# Altium project Orient2.PrjPcb (part 4 of 6)

## Sheet P06_Boot.SchDoc
size A
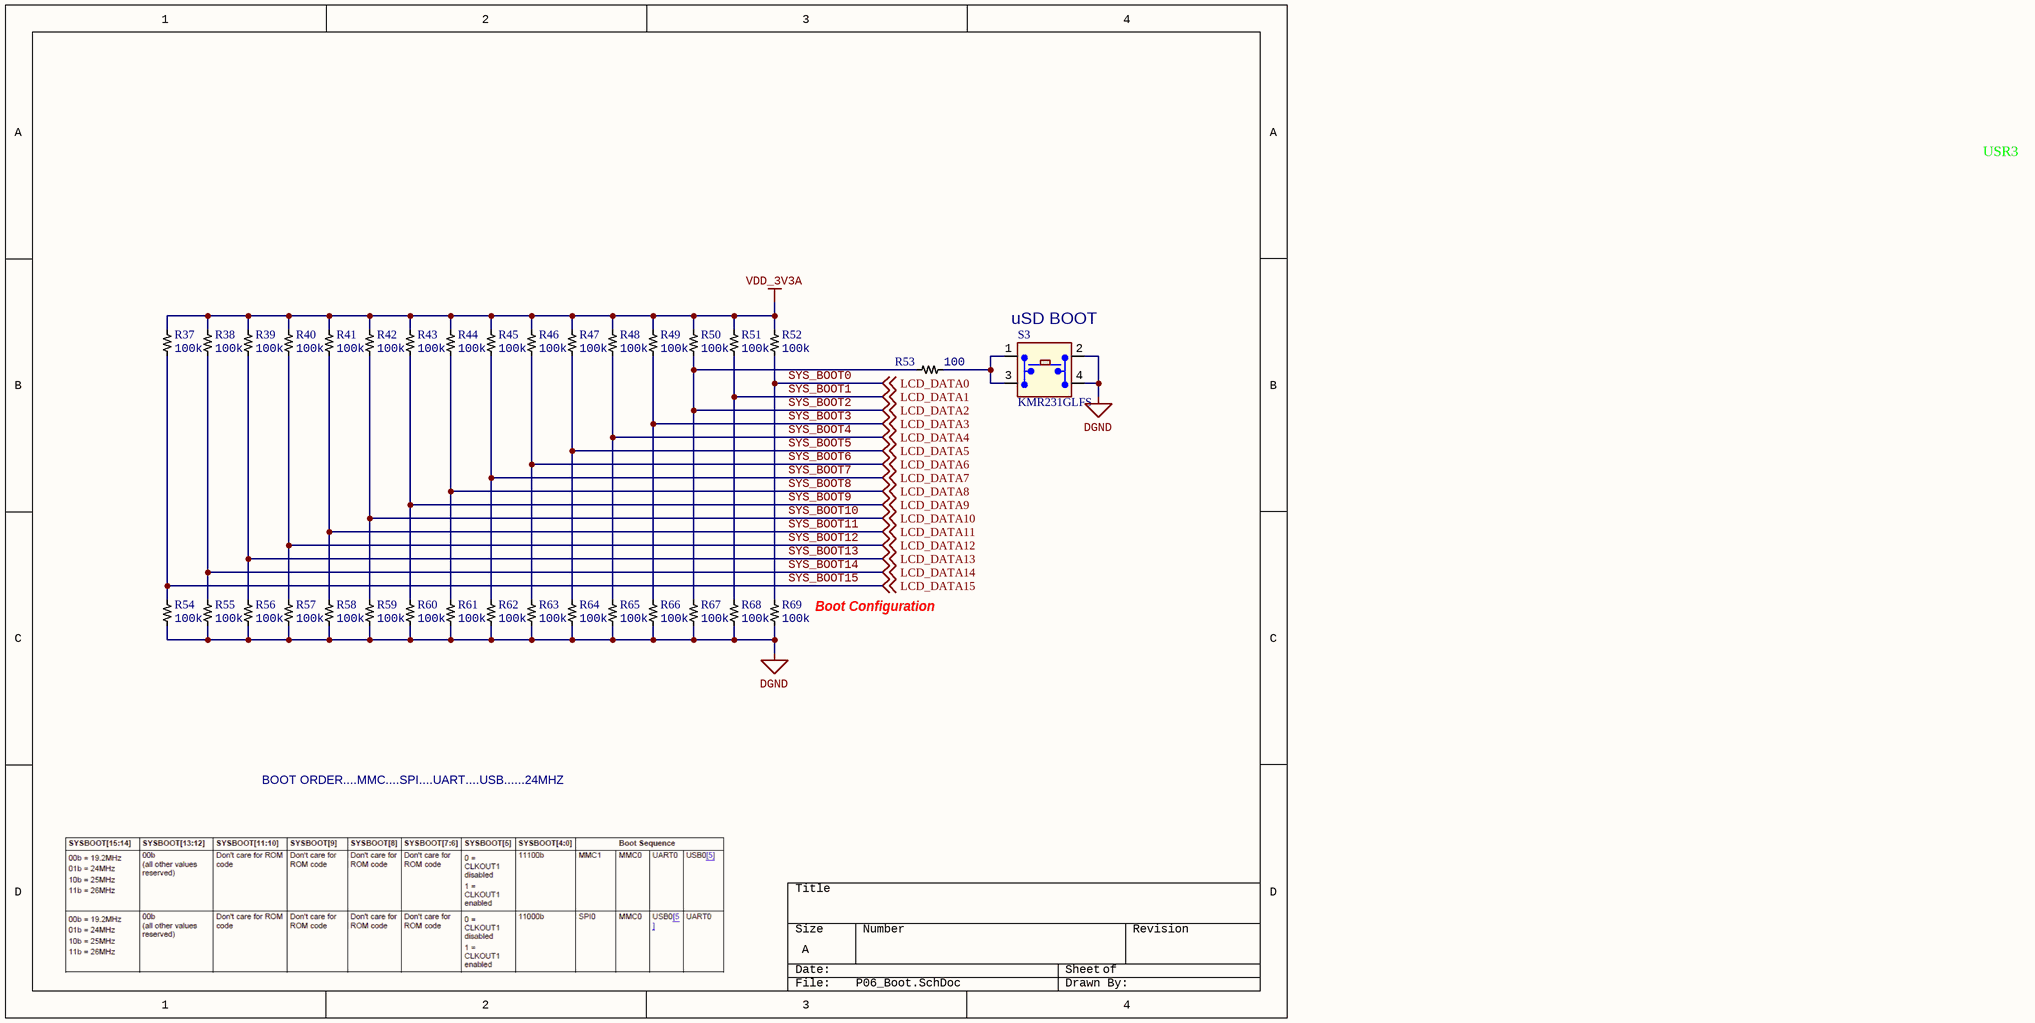
[diagram p5: P06_Boot.SchDoc]

### Parts
R37  Resistance: 100k  [RES0402]  (hidden comment: RC0402FR-07100KL)
R38  Resistance: 100k  [RES0402]  (hidden comment: RC0402FR-07100KL)
R39  Resistance: 100k  [RES0402]  (hidden comment: RC0402FR-07100KL)
R40  Resistance: 100k  [RES0402]  (hidden comment: RC0402FR-07100KL)
R41  Resistance: 100k  [RES0402]  (hidden comment: RC0402FR-07100KL)
R42  Resistance: 100k  [RES0402]  (hidden comment: RC0402FR-07100KL)
R43  Resistance: 100k  [RES0402]  (hidden comment: RC0402FR-07100KL)
R44  Resistance: 100k  [RES0402]  (hidden comment: RC0402FR-07100KL)
R45  Resistance: 100k  [RES0402]  (hidden comment: RC0402FR-07100KL)
R46  Resistance: 100k  [RES0402]  (hidden comment: RC0402FR-07100KL)
R47  Resistance: 100k  [RES0402]  (hidden comment: RC0402FR-07100KL)
R48  Resistance: 100k  [RES0402]  (hidden comment: RC0402FR-07100KL)
R49  Resistance: 100k  [RES0402]  (hidden comment: RC0402FR-07100KL)
R50  Resistance: 100k  [RES0402]  (hidden comment: RC0402FR-07100KL)
R51  Resistance: 100k  [RES0402]  (hidden comment: RC0402FR-07100KL)
R52  Resistance: 100k  [RES0402]  (hidden comment: RC0402FR-07100KL)
R53  Resistance: 100  [RES0402]  (hidden comment: RC0402FR-07100RL)
R54  Resistance: 100k  [RES0402]  (hidden comment: RC0402FR-07100KL)
R55  Resistance: 100k  [RES0402]  (hidden comment: RC0402FR-07100KL)
R56  Resistance: 100k  [RES0402]  (hidden comment: RC0402FR-07100KL)
R57  Resistance: 100k  [RES0402]  (hidden comment: RC0402FR-07100KL)
R58  Resistance: 100k  [RES0402]  (hidden comment: RC0402FR-07100KL)
R59  Resistance: 100k  [RES0402]  (hidden comment: RC0402FR-07100KL)
R60  Resistance: 100k  [RES0402]  (hidden comment: RC0402FR-07100KL)
R61  Resistance: 100k  [RES0402]  (hidden comment: RC0402FR-07100KL)
R62  Resistance: 100k  [RES0402]  (hidden comment: RC0402FR-07100KL)
R63  Resistance: 100k  [RES0402]  (hidden comment: RC0402FR-07100KL)
R64  Resistance: 100k  [RES0402]  (hidden comment: RC0402FR-07100KL)
R65  Resistance: 100k  [RES0402]  (hidden comment: RC0402FR-07100KL)
R66  Resistance: 100k  [RES0402]  (hidden comment: RC0402FR-07100KL)
R67  Resistance: 100k  [RES0402]  (hidden comment: RC0402FR-07100KL)
R68  Resistance: 100k  [RES0402]  (hidden comment: RC0402FR-07100KL)
R69  Resistance: 100k  [RES0402]  (hidden comment: RC0402FR-07100KL)
S3  KMR231GLFS  [SW4SMD_63X161LS]

### Nets
DGND: R54.1 R55.1 R56.1 R57.1 R58.1 R59.1 R60.1 R61.1 R62.1 R63.1 R64.1 R65.1 R66.1 R67.1 R68.1 R69.1 S3.2(A2) S3.4
VDD_3V3A: R37.2 R38.2 R39.2 R40.2 R41.2 R42.2 R43.2 R44.2 R45.2 R46.2 R47.2 R48.2 R49.2 R50.2 R51.2 R52.2
SYS_BOOT0: R52.1 R69.2 ; off-sheet LCD_DATA0  [also labelled LCD_DATA0]
SYS_BOOT1: R51.1 R68.2 ; off-sheet LCD_DATA1  [also labelled LCD_DATA1]
SYS_BOOT2: R50.1 R53.1 R67.2 ; off-sheet LCD_DATA2  [also labelled LCD_DATA2]
SYS_BOOT3: R49.1 R66.2 ; off-sheet LCD_DATA3  [also labelled LCD_DATA3]
SYS_BOOT4: R48.1 R65.2 ; off-sheet LCD_DATA4  [also labelled LCD_DATA4]
SYS_BOOT5: R47.1 R64.2 ; off-sheet LCD_DATA5  [also labelled LCD_DATA5]
SYS_BOOT6: R46.1 R63.2 ; off-sheet LCD_DATA6  [also labelled LCD_DATA6]
SYS_BOOT7: R45.1 R62.2 ; off-sheet LCD_DATA7  [also labelled LCD_DATA7]
SYS_BOOT8: R44.1 R61.2 ; off-sheet LCD_DATA8  [also labelled LCD_DATA8]
SYS_BOOT9: R43.1 R60.2 ; off-sheet LCD_DATA9  [also labelled LCD_DATA9]
SYS_BOOT10: R42.1 R59.2 ; off-sheet LCD_DATA10  [also labelled LCD_DATA10]
SYS_BOOT11: R41.1 R58.2 ; off-sheet LCD_DATA11  [also labelled LCD_DATA11]
SYS_BOOT12: R40.1 R57.2 ; off-sheet LCD_DATA12  [also labelled LCD_DATA12]
SYS_BOOT13: R39.1 R56.2 ; off-sheet LCD_DATA13  [also labelled LCD_DATA13]
SYS_BOOT14: R38.1 R55.2 ; off-sheet LCD_DATA14  [also labelled LCD_DATA14]
SYS_BOOT15: R37.1 R54.2 ; off-sheet LCD_DATA15  [also labelled LCD_DATA15]
NetR53_2: R53.2 S3.1(A1) S3.3(A3)

### Notes on the sheet
- USR3
- (near S3) uSD BOOT
- (near R69) Boot Configuration
- BOOT ORDER....MMC....SPI....UART....USB......24MHZ

### Library data of the parts
R37-R52 R54-R69 = RES_100k: Resistor 100kOhm 0402 SMD; Manufacturer: Yageo; Temperature Coefficient: 100ppm/°C; Tolerance: 1%; Power Rating: 63mW; Voltage Rating: 50V; Composition: Thick Film; Features: Moisture Resistant; Height: 0.016inch; Manufacturer Part Number: RC0402FR-07100KL; Number of Terminations: 2; Packaging: Tape and Reel; RoHS: Yes; Supplier 1: Mouser; Supplier Part Number 1: 603-RC0402FR-07100KL; Case/Package: 0402; Case Code (Metric): 1005; Case Code (Imperial): 0402; Min Operating Temperature: -55°C; Max Operating Temperature: 155°C; Package Quantity: 1; Termination: SMD/SMT; Military Standard: Not; Max Power Dissipation: 63mW; Working Voltage: 50V; Length: 0.039inch; Width: 0.02inch; Depth: 0.5mm; REACH SVHC: No SVHC; Lead Free: Lead Free; ComponentLink2Description: Datasheet; ComponentLink2URL: https://www.yageo.com/upload/media/product/productsearch/datasheet/rchip/PYu-RC_Group_51_RoHS_L_10.pdf; Supplier 2: Digi-Key; Supplier Part Number 2: 311-100KLRCT-ND
R53 = RES_100: Resistor 100Ohm 0402 SMD; Manufacturer: Yageo; Temperature Coefficient: 100ppm/°C; Tolerance: 1%; Power Rating: 62.5mW; Voltage Rating: 50V; ComponentLink1Description: https://datasheet.ciiva.com/7849/1784430-7849810.pdf?src-supplier=Element14; ComponentLink1URL: https://datasheet.ciiva.com/7849/1784430-7849810.pdf?src-supplier=Element14; Composition: Thick Film; Height: 0.32mm; Manufacturer Part Number: RC0402FR-07100RL; Packaging: Tape and Reel; Pricing 1: 1=0.10000, 10=0.01600, 100=0.00640, 1000=0.00289, 2500=0.00251, 5000=0.00207 (USD); RoHS: Yes; Stock 1: 45000776; Supplier 1: Digi-Key; Case/Package: 0402; Number of Pins: 2; Case Code (Imperial): 0402; Case Code (Metric): 1005; Min Operating Temperature: -55°C; Max Operating Temperature: 155°C; Military Standard: Not; Voltage Rating (DC): 50V; Termination: SMD/SMT; Length: 1mm; Width: 0.5mm; Depth: 0.5mm; REACH SVHC: No SVHC; Lead Free: Lead Free; ComponentLink2URL: https://datasheet.ciiva.com/11808/0900766b80c66297-11808765.pdf?src-supplier=RSComponents; ComponentLink2Description: https://datasheet.ciiva.com/11808/0900766b80c66297-11808765.pdf?src-supplier=RSComponents; ComponentLink3URL: https://datasheet.ciiva.com/12667/pyu-rc0402-51-rohs-l-6-r-12667957.pdf?src-supplier=Mouser; ComponentLink3Description: https://datasheet.ciiva.com/12667/pyu-rc0402-51-rohs-l-6-r-12667957.pdf?src-supplier=Mouser; ComponentLink4URL: https://datasheet.ciiva.com/22747/1018594-22747511.pdf?src-supplier=Element14; ComponentLink4Description: https://datasheet.ciiva.com/22747/1018594-22747511.pdf?src-supplier=Element14; ComponentLink5URL: https://datasheet.ciiva.com/28367/1018594-28367226.pdf?src-supplier=Element14; ComponentLink5Description: https://datasheet.ciiva.com/28367/1018594-28367226.pdf?src-supplier=Element14; ComponentLink6URL: https://datasheet.ciiva.com/16740/pyu-rc0402-51-rohs-l-6-r-16740566.pdf?src-supplier=Future+Electronics; ComponentLink6Description: https://datasheet.ciiva.com/16740/pyu-rc0402-51-rohs-l-6-r-16740566.pdf?src-supplier=Future+Electronics; ComponentLink7URL: https://datasheet.ciiva.com/15189/getdatasheetpartid-329466-15189335.pdf?src-supplier=Verical; ComponentLink7Description: https://datasheet.ciiva.com/15189/getdatasheetpartid-329466-15189335.pdf?src-supplier=Verical
S3 = KMR2: Microminiature Tact Switch for SMT; Manufacturer: C&K Components; Circuit: SPST-NO; Switch Function: Off-Mom; Contact Rating @ Voltage: 0.05A @ 32VDC; Actuator Type: Standard; Actuator Height off PCB, from Pins: 1.90mm; Actuator Orientation: Top Actuated; Outline: 4.60mm x 2.80mm; Illumination: Non-Illuminated; Operating Force: 300gf; Switch Travel: 0.25mm; Mechanical Life: 150,000 Cycles; Supplier 1: Digi-Key; Supplier Part Number 1: 401-1429-6-ND; Manufacturer Part Number: KMR231GLFS; RoHS: RoHS Compliant; Category: Switches; Stock 1: 32289; Pricing 1: 1=0.44, 10=0.416, 25=0.3744, 50=0.3326, 100=0.3188, 250=0.29108, 500=0.2772, 1000=0.22869 (USD); Mounting Type: Surface Mount; Termination Style: Gull Wing; Illumination Voltage (Nominal): -; Illumination Type, Color: -; Ingress Protection: -; Features: Grounding Pin; Packaging: Digi-Reel®; Actuator Material: -; Operating Temperature: -40°C ~ 85°C; ComponentLink1URL: http://www.ck-components.com/index.php?module=media&action=Display&cmpref=14414&lang=en&width=&height=&format=&alt=; ComponentLink1Description: http://www.ck-components.com/index.php?module=media&action=Display&cmpref=14414&lang=en&width=&height=&format=&alt=

## Sheet P07_DDR3.SchDoc
size A
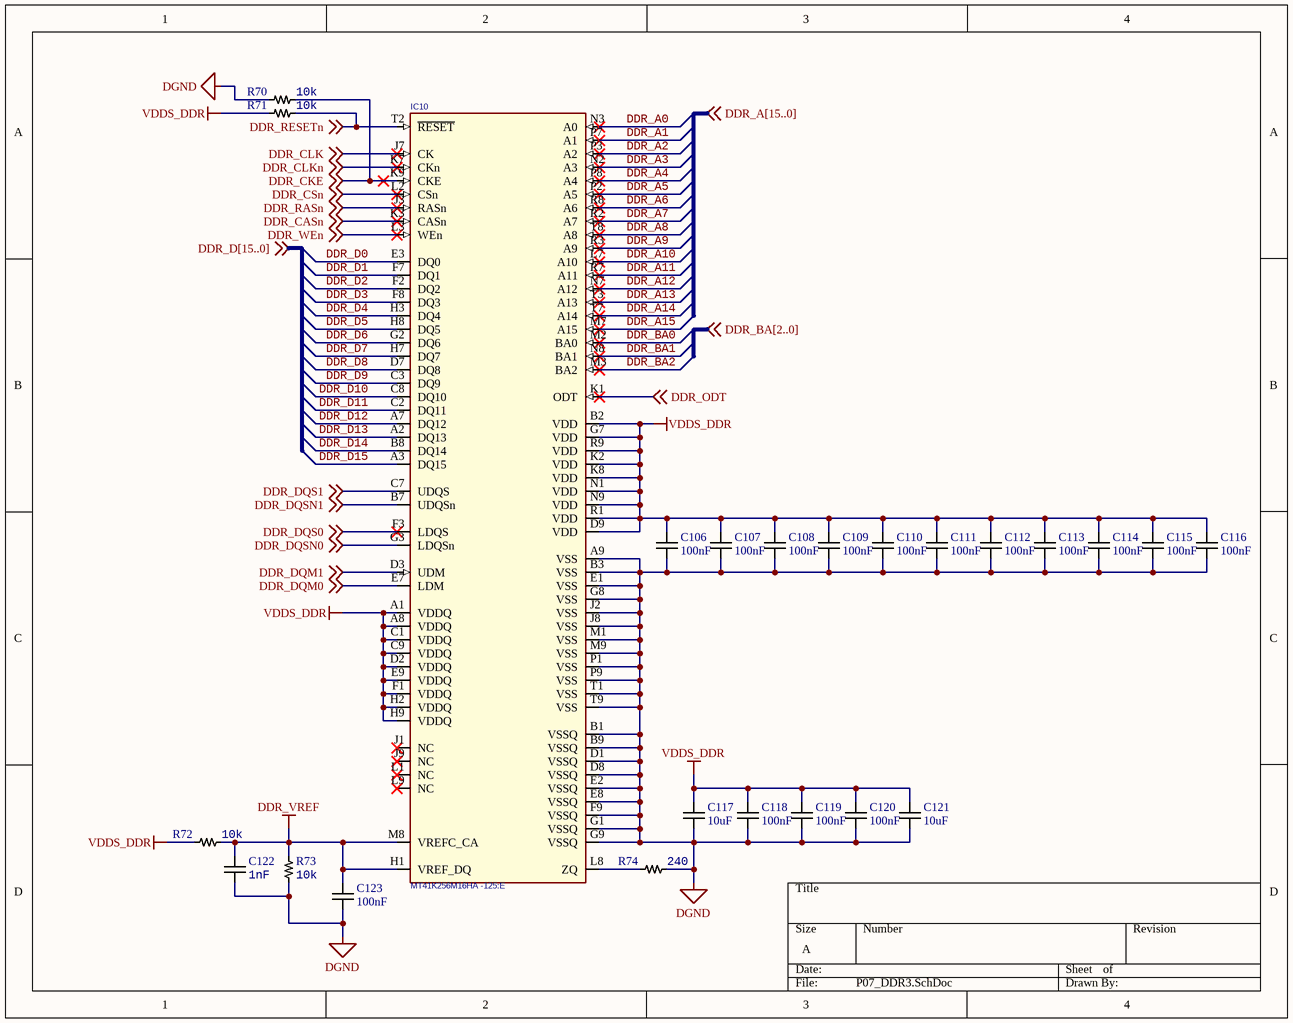
[diagram p6: P07_DDR3.SchDoc]

### Parts
C106  Capacitance: 100nF  [CAP0402]  (hidden comment: C0402C104K4RACTU)
C107  Capacitance: 100nF  [CAP0402]  (hidden comment: C0402C104K4RACTU)
C108  Capacitance: 100nF  [CAP0402]  (hidden comment: C0402C104K4RACTU)
C109  Capacitance: 100nF  [CAP0402]  (hidden comment: C0402C104K4RACTU)
C110  Capacitance: 100nF  [CAP0402]  (hidden comment: C0402C104K4RACTU)
C111  Capacitance: 100nF  [CAP0402]  (hidden comment: C0402C104K4RACTU)
C112  Capacitance: 100nF  [CAP0402]  (hidden comment: C0402C104K4RACTU)
C113  Capacitance: 100nF  [CAP0402]  (hidden comment: C0402C104K4RACTU)
C114  Capacitance: 100nF  [CAP0402]  (hidden comment: C0402C104K4RACTU)
C115  Capacitance: 100nF  [CAP0402]  (hidden comment: C0402C104K4RACTU)
C116  Capacitance: 100nF  [CAP0402]  (hidden comment: C0402C104K4RACTU)
C117  Capacitance: 10uF  [CAP0805]  (hidden comment: C2012X6S1A106K085AC)
C118  Capacitance: 100nF  [CAP0402]  (hidden comment: C0402C104K4RACTU)
C119  Capacitance: 100nF  [CAP0402]  (hidden comment: C0402C104K4RACTU)
C120  Capacitance: 100nF  [CAP0402]  (hidden comment: C0402C104K4RACTU)
C121  Capacitance: 10uF  [CAP0805]  (hidden comment: C2012X6S1A106K085AC)
C122  Capacitance: 1nF  [CAP0402]  (hidden comment: CC0402KRX7R9BB102)
C123  Capacitance: 100nF  [CAP0402]  (hidden comment: C0402C104K4RACTU)
IC10  MT41K256M16HA -125:E  [BGA96_T9_P8_9X14]
R70  Resistance: 10k  [RES0402]  (hidden comment: RC0402FR-0710KL)
R71  Resistance: 10k  [RES0402]  (hidden comment: RC0402FR-0710KL)
R72  Resistance: 10k  [RES0402]  (hidden comment: RC0402FR-0710KL)
R73  Resistance: 10k  [RES0402]  (hidden comment: RC0402FR-0710KL)
R74  Resistance: 240  [RES0402]  (hidden comment: RC0402FR-07240RL)

### Nets
DDR_VREF: C122.1 C123.1 IC10.H1(VREF_DQ) IC10.M8(VREFC_CA) R72.1 R73.2
DGND: C106.2 C107.2 C108.2 C109.2 C110.2 C111.2 C112.2 C113.2 C114.2 C115.2 C116.2 C117.1 C118.2 C119.2 C120.2 C121.1 C122.2 C123.2 IC10.A9(VSS) IC10.B1(VSSQ) IC10.B3(VSS) IC10.B9(VSSQ) IC10.D1(VSSQ) IC10.D8(VSSQ) IC10.E1(VSS) IC10.E2(VSSQ) IC10.E8(VSSQ) IC10.F9(VSSQ) IC10.G1(VSSQ) IC10.G8(VSS) IC10.G9(VSSQ) IC10.J2(VSS) IC10.J8(VSS) IC10.M1(VSS) IC10.M9(VSS) IC10.P1(VSS) IC10.P9(VSS) IC10.T1(VSS) IC10.T9(VSS) R70.2 R73.1 R74.2
VDDS_DDR: C106.1 C107.1 C108.1 C109.1 C110.1 C111.1 C112.1 C113.1 C114.1 C115.1 C116.1 C117.2 C118.1 C119.1 C120.1 C121.2 IC10.A1(VDDQ) IC10.A8(VDDQ) IC10.B2(VDD) IC10.C1(VDDQ) IC10.C9(VDDQ) IC10.D2(VDDQ) IC10.D9(VDD) IC10.E9(VDDQ) IC10.F1(VDDQ) IC10.G7(VDD) IC10.H2(VDDQ) IC10.H9(VDDQ) IC10.K2(VDD) IC10.K8(VDD) IC10.N1(VDD) IC10.N9(VDD) IC10.R1(VDD) IC10.R9(VDD) R71.2 R72.2
DDR_A0: IC10.N3(A0)
DDR_A1: IC10.P7(A1)
DDR_A2: IC10.P3(A2)
DDR_A3: IC10.N2(A3)
DDR_A4: IC10.P8(A4)
DDR_A5: IC10.P2(A5)
DDR_A6: IC10.R8(A6)
DDR_A7: IC10.R2(A7)
DDR_A8: IC10.T8(A8)
DDR_A9: IC10.R3(A9)
DDR_A10: IC10.L7(A10)
DDR_A11: IC10.R7(A11)
DDR_A12: IC10.N7(A12)
DDR_A13: IC10.T3(A13)
DDR_A14: IC10.T7(A14)
DDR_A15: IC10.M7(A15)
DDR_BA0: IC10.M2(BA0)
DDR_BA1: IC10.N8(BA1)
DDR_BA2: IC10.M3(BA2)
DDR_CASn: IC10.K3(CASn) ; off-sheet DDR_CASn
DDR_CKE: IC10.K9(CKE) R70.1 ; off-sheet DDR_CKE
DDR_CLK: IC10.J7(CK) ; off-sheet DDR_CLK
DDR_CLKn: IC10.K7(CKn) ; off-sheet DDR_CLKn
DDR_CSn: IC10.L2(CSn) ; off-sheet DDR_CSn
DDR_D0: IC10.E3(DQ0)
DDR_D1: IC10.F7(DQ1)
DDR_D2: IC10.F2(DQ2)
DDR_D3: IC10.F8(DQ3)
DDR_D4: IC10.H3(DQ4)
DDR_D5: IC10.H8(DQ5)
DDR_D6: IC10.G2(DQ6)
DDR_D7: IC10.H7(DQ7)
DDR_D8: IC10.D7(DQ8)
DDR_D9: IC10.C3(DQ9)
DDR_D10: IC10.C8(DQ10)
DDR_D11: IC10.C2(DQ11)
DDR_D12: IC10.A7(DQ12)
DDR_D13: IC10.A2(DQ13)
DDR_D14: IC10.B8(DQ14)
DDR_D15: IC10.A3(DQ15)
DDR_DQM0: IC10.E7(LDM) ; off-sheet DDR_DQM0
DDR_DQM1: IC10.D3(UDM) ; off-sheet DDR_DQM1
DDR_DQS0: IC10.F3(LDQS) ; off-sheet DDR_DQS0
DDR_DQS1: IC10.C7(UDQS) ; off-sheet DDR_DQS1
DDR_DQSN0: IC10.G3(LDQSn) ; off-sheet DDR_DQSN0
DDR_DQSN1: IC10.B7(UDQSn) ; off-sheet DDR_DQSN1
DDR_ODT: IC10.K1(ODT) ; off-sheet DDR_ODT
DDR_RASn: IC10.J3(RASn) ; off-sheet DDR_RASn
DDR_RESETn: IC10.T2(~{RESET}) R71.1 ; off-sheet DDR_RESETn
DDR_WEn: IC10.L3(WEn) ; off-sheet DDR_WEn
NetIC10_L8: IC10.L8(ZQ) R74.1

Not connected (* = marked no-connect by the designer): IC10 J1(NC)* J9(NC)* L1(NC)* L9(NC)*

### Library data of the parts
C106-C116 C118-C120 C123 = CAP_100nF: as C3 on sheet P01_PMIC; Supplier 1: Digi-Key; Supplier Part Number 1: 399-3521-1-ND; Manufacturer Part Number: C0402C104K4RACTU; RoHS: Yes; Stock 1: 6512243; Pricing 1: 1=0.10000, 10=0.04200, 100=0.01860, 500=0.01328, 1000=0.01044, 2500=0.00949, 5000=0.00873 (USD); Packaging: Tape and Reel; Mount: Surface Mount; Case/Package: 0402; Case Code (Imperial): 0402; Case Code (Metric): 1005; Contact Plating: Tin,Matte; Min Operating Temperature: -55°C; Max Operating Temperature: 125°C; Package Quantity: 10000; Voltage Rating: 16V; Termination: SMD/SMT; Length: 1mm; Height: 0.5mm; Width: 0.5mm; Depth: 0.5mm; Radiation Hardening: No; ComponentLink2URL: https://datasheet.ciiva.com/18192/getdatasheetpartid-385384-18192412.pdf?src-supplier=Verical; ComponentLink2Description: Datasheet
C117 C121 = CAP_10uF: as C40 on sheet P04_MPU3; Supplier 1: Digi-Key; Supplier Part Number 1: 445-7613-1-ND; Manufacturer Part Number: C2012X6S1A106K085AC; RoHS: Yes; Stock 1: 46852; Pricing 1: 1=0.30000, 10=0.20500, 100=0.11610, 500=0.08198, 1000=0.07173 (USD); Packaging: Tape and Reel; Mount: Surface Mount; Case/Package: 0805; Weight: 0.000194oz; Case Code (Metric): 2012; Case Code (Imperial): 0805; Min Operating Temperature: -55°C; Max Operating Temperature: 105°C; Termination: SMD/SMT; Package Quantity: 4000; Voltage Rating (DC): 10V; Composition: Ceramic; Length: 2mm; Height: 1.25mm; Depth: 1.25mm; Width: 0.049inch; Thickness: 0.037inch; REACH SVHC: No SVHC; Lead Free: Lead Free; ComponentLink3URL: https://datasheet.ciiva.com/6290/tdkmlcccaprange-6290501.pdf?src-supplier=Digi-Key; ComponentLink3Description: Datasheet
C122 = CAP_1nF: MLCC 1nF 0402 SMD; Manufacturer: Yageo; Dielectric Material: Ceramic; Tolerance: 10%; Voltage Rating: 50V; Insulation Resistance: 100GR; Supplier 1: Digi-Key; Manufacturer Part Number: CC0402KRX7R9BB102; Stock 1: 3539064; Pricing 1: 1=0.10000, 10=0.02100, 100=0.00920, 500=0.00654, 1000=0.00514, 2500=0.00468, 5000=0.00430 (USD); RoHS: Yes; Mount: Surface Mount; Case/Package: 0402; Case Code (Metric): 1005; Case Code (Imperial): 0402; Min Operating Temperature: -55°C; Max Operating Temperature: 125°C; Packaging: Tape and Reel; Length: 0.039inch; Width: 0.02inch; Thickness: 0.022inch; Lead Free: Lead Free; Halogen Free: Halogen Free; ComponentLink1URL: https://datasheet.ciiva.com/11786/0900766b8079c870-11786157.pdf?src-supplier=RSComponents; ComponentLink1Description: https://datasheet.ciiva.com/11786/0900766b8079c870-11786157.pdf?src-supplier=RSComponents; ComponentLink2URL: https://datasheet.ciiva.com/143/mlccorderingcode-143956.pdf?src-supplier=Digi-Key; ComponentLink2Description: https://datasheet.ciiva.com/143/mlccorderingcode-143956.pdf?src-supplier=Digi-Key; ComponentLink3URL: https://datasheet.ciiva.com/143/mlccorderingcode-143957.pdf?src-supplier=Digi-Key; ComponentLink3Description: https://datasheet.ciiva.com/143/mlccorderingcode-143957.pdf?src-supplier=Digi-Key; ComponentLink4URL: https://datasheet.ciiva.com/143/mlccorderingcode-143958.pdf?src-supplier=Digi-Key; ComponentLink4Description: https://datasheet.ciiva.com/143/mlccorderingcode-143958.pdf?src-supplier=Digi-Key; ComponentLink5URL: https://datasheet.ciiva.com/13389/upy-gp-np0-16v-to-50v-8-13389974.pdf?src-supplier=Mouser; ComponentLink5Description: https://datasheet.ciiva.com/13389/upy-gp-np0-16v-to-50v-8-13389974.pdf?src-supplier=Mouser; ComponentLink6URL: https://datasheet.ciiva.com/16625/upy-gphc-x7r-6-3v-to-50v-8-16625512.pdf?src-supplier=Avnet+Europe; ComponentLink6Description: https://datasheet.ciiva.com/16625/upy-gphc-x7r-6-3v-to-50v-8-16625512.pdf?src-supplier=Avnet+Europe; ComponentLink7URL: https://datasheet.ciiva.com/15189/getdatasheetpartid-403474-15189131.pdf?src-supplier=Verical; ComponentLink7Description: https://datasheet.ciiva.com/15189/getdatasheetpartid-403474-15189131.pdf?src-supplier=Verical; ComponentLink8URL: https://datasheet.ciiva.com/7978/1489800-7978092.pdf?src-supplier=Element14; ComponentLink8Description: https://datasheet.ciiva.com/7978/1489800-7978092.pdf?src-supplier=Element14; ComponentLink9URL: https://datasheet.ciiva.com/22749/1489800-22749213.pdf?src-supplier=Element14; ComponentLink9Description: https://datasheet.ciiva.com/22749/1489800-22749213.pdf?src-supplier=Element14
IC10 = MT41K256M16HA: DDR2 SDRAM 2Gb (256Mx8); Manufacturer: Micron Technology; Lead Time: 0 weeks; Peak Solder Temperature: 260 deg C; Supplier 1: Arrow; Supplier Part Number 1: 52128708S9959891N2406; Manufacturer Part Number: MT41K256M16HA-125:E; RoHS: CHINA ROHS: Compliant / EU ROHS: Compliant; Stock 1: 0; Pricing 1: 0=10.09 (USD); Package Quantity: 1; Termination Finish: Sn/Ag/Cu; China ROHS Lead (X -> above / O -> below threshold): O; China ROHS Mercury (X -> above / O -> below threshold): O; China ROHS Cadmium (X -> above / O -> below threshold): O; China ROHS Hex Chromium (X -> above / O -> below threshold): O; China ROHS PBB (X -> above / O -> below threshold): O; China ROHS PBDE (X -> above / O -> below threshold): O; EU_ROHS_PROD_EXEMPTION_BY_SUPP: N/R; ComponentLink1URL: http://components.arrow.com/partservice/dataview/altium/52128708S9959891N2406?apiKey=aa438727d59eed98c4bed826d8d949c84cb5e685b92bf87346a0226bd2658797; ComponentLink1Description: http://components.arrow.com/partservice/dataview/altium/52128708S9959891N2406?apiKey=aa438727d59eed98c4bed826d8d949c84cb5e685b92bf87346a0226bd2658797
R70-R73 = RES_10k: as R18 on sheet P02_MPU1_JTAG; ComponentLink1Description: https://datasheet.ciiva.com/7660/38568-7660787.pdf?src-supplier=Element14; ComponentLink1URL: https://datasheet.ciiva.com/7660/38568-7660787.pdf?src-supplier=Element14; Composition: Thick Film; Height: 0.32mm; Manufacturer Part Number: RC0402FR-0710KL; Number of Terminations: 2; Packaging: Tape and Reel; Pricing 1: 1=0.10000, 10=0.01500, 100=0.00600, 1000=0.00270, 2500=0.00235, 5000=0.00194 (USD); RoHS: Yes; Stock 1: 72891652; Supplier 1: Digi-Key; Case/Package: 0402; Number of Pins: 2; Case Code (Imperial): 0402; Case Code (Metric): 1005; Min Operating Temperature: -55°C; Max Operating Temperature: 155°C; Voltage Rating: 50V; Termination: SMD/SMT; Military Standard: Not; Working Voltage: 50V; Length: 1mm; Width: 0.5mm; Depth: 0.5mm; Lead Pitch: 0.2mm; REACH SVHC: No SVHC; Lead Free: Lead Free; ComponentLink2URL: https://datasheet.ciiva.com/7983/1018594-7983486.pdf?src-supplier=Element14; ComponentLink2Description: https://datasheet.ciiva.com/7983/1018594-7983486.pdf?src-supplier=Element14; ComponentLink3URL: https://datasheet.ciiva.com/7849/1784430-7849813.pdf?src-supplier=Element14; ComponentLink3Description: https://datasheet.ciiva.com/7849/1784430-7849813.pdf?src-supplier=Element14; ComponentLink4URL: https://datasheet.ciiva.com/7849/1686128-7849814.pdf?src-supplier=Element14; ComponentLink4Description: https://datasheet.ciiva.com/7849/1686128-7849814.pdf?src-supplier=Element14; ComponentLink5URL: https://datasheet.ciiva.com/7849/1784430-7849815.pdf?src-supplier=Element14; ComponentLink5Description: https://datasheet.ciiva.com/7849/1784430-7849815.pdf?src-supplier=Element14; ComponentLink6URL: https://datasheet.ciiva.com/22747/1018594-22747512.pdf?src-supplier=Element14; ComponentLink6Description: https://datasheet.ciiva.com/22747/1018594-22747512.pdf?src-supplier=Element14; ComponentLink7URL: https://datasheet.ciiva.com/12667/pyu-rc0402-51-rohs-l-6-r-12667067.pdf?src-supplier=Mouser; ComponentLink7Description: https://datasheet.ciiva.com/12667/pyu-rc0402-51-rohs-l-6-r-12667067.pdf?src-supplier=Mouser
R74 = RES_240: Resistor 240Ohm 0402 SMD; Manufacturer: Yageo Phycomp; Temperature Coefficient: 100ppm/°C; Tolerance: 1%; Power Rating: 63mW; Voltage Rating (DC): 50V; Supplier 1: Digi-Key; Manufacturer Part Number: RC0402FR-07240RL; RoHS: Yes; Stock 1: 5154046; Pricing 1: 1=0.10000, 10=0.01600, 100=0.00640, 1000=0.00289, 2500=0.00251, 5000=0.00207 (USD); Height: 0.32mm; Packaging: Cut Tape; ComponentLink1URL: http://www.mouser.com/ds/2/447/PYu-RC0402_51_RoHS_L_6_r-8721.pdf?src-supplier=Mouser; ComponentLink1Description: http://www.mouser.com/ds/2/447/PYu-RC0402_51_RoHS_L_6_r-8721.pdf?src-supplier=Mouser; Mount: Surface Mount; Case/Package: 0402; Number of Pins: 2; Min Operating Temperature: -55°C; Max Operating Temperature: 155°C; Length: 1mm; Depth: 0.5mm; REACH SVHC: No SVHC; Lead Free: Lead Free; ComponentLink2URL: http://www.farnell.com/datasheets/2167052.pdf?src-supplier=Farnell; ComponentLink2Description: http://www.farnell.com/datasheets/2167052.pdf?src-supplier=Farnell; ComponentLink3URL: http://www.yageo.com/documents/recent/PYu-RC_Group_51_RoHS_L_9.pdf?src-supplier=Digi-Key; ComponentLink3Description: http://www.yageo.com/documents/recent/PYu-RC_Group_51_RoHS_L_9.pdf?src-supplier=Digi-Key; ComponentLink4URL: http://www.yageo.com/documents/recent/PYu-RC_Group_51_RoHS_L_10.pdf?src-supplier=Digi-Key; ComponentLink4Description: http://www.yageo.com/documents/recent/PYu-RC_Group_51_RoHS_L_10.pdf?src-supplier=Digi-Key; ComponentLink5URL: http://www.farnell.com/datasheets/2167052.pdf?src-supplier=Element14; ComponentLink5Description: http://www.farnell.com/datasheets/2167052.pdf?src-supplier=Element14

## Sheet P08_eMMC.SchDoc
size A
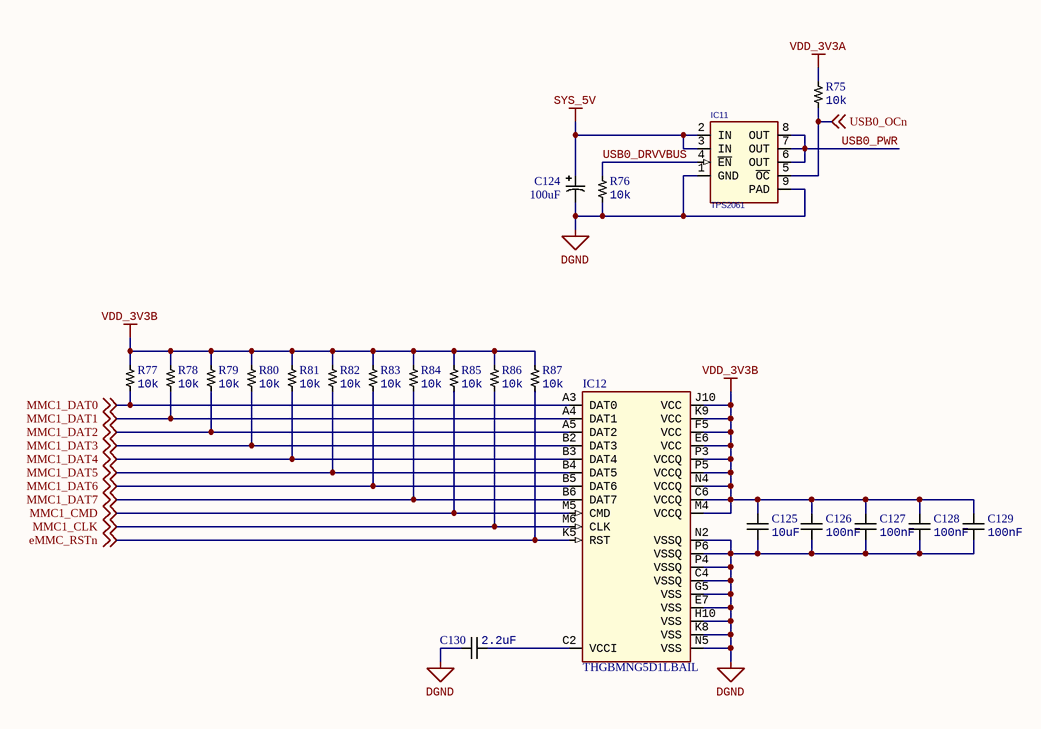
[diagram p7: P08_eMMC.SchDoc]

### Parts
C124  Capacitance: 100uF  [CAP6.6x6.6]  (hidden comment: EEE-0JA101SP)
C125  Capacitance: 10uF  [CAP0805]  (hidden comment: C2012X6S1A106K085AC)
C126  Capacitance: 100nF  [CAP0402]  (hidden comment: C0402C104K4RACTU)
C127  Capacitance: 100nF  [CAP0402]  (hidden comment: C0402C104K4RACTU)
C128  Capacitance: 100nF  [CAP0402]  (hidden comment: C0402C104K4RACTU)
C129  Capacitance: 100nF  [CAP0402]  (hidden comment: C0402C104K4RACTU)
C130  Capacitance: 2.2uF  [CAP0402]  (hidden comment: C1005X5R0J225K050BC)
IC11  TPS2061  [HVSSOP-8]
IC12  THGBMNG5D1LBAIL  [WFBGA-153]
R75  Resistance: 10k  [RES0402]  (hidden comment: RC0402FR-0710KL)
R76  Resistance: 10k  [RES0402]  (hidden comment: RC0402FR-0710KL)
R77  Resistance: 10k  [RES0402]  (hidden comment: RC0402FR-0710KL)
R78  Resistance: 10k  [RES0402]  (hidden comment: RC0402FR-0710KL)
R79  Resistance: 10k  [RES0402]  (hidden comment: RC0402FR-0710KL)
R80  Resistance: 10k  [RES0402]  (hidden comment: RC0402FR-0710KL)
R81  Resistance: 10k  [RES0402]  (hidden comment: RC0402FR-0710KL)
R82  Resistance: 10k  [RES0402]  (hidden comment: RC0402FR-0710KL)
R83  Resistance: 10k  [RES0402]  (hidden comment: RC0402FR-0710KL)
R84  Resistance: 10k  [RES0402]  (hidden comment: RC0402FR-0710KL)
R85  Resistance: 10k  [RES0402]  (hidden comment: RC0402FR-0710KL)
R86  Resistance: 10k  [RES0402]  (hidden comment: RC0402FR-0710KL)
R87  Resistance: 10k  [RES0402]  (hidden comment: RC0402FR-0710KL)

### Nets
DGND: C124.2(C) C125.1 C126.2 C127.2 C128.2 C129.2 C130.2 IC11.1(GND) IC11.9(PAD) IC12.C4(VSSQ) IC12.E7(VSS) IC12.G5(VSS) IC12.H10(VSS) IC12.K8(VSS) IC12.N2(VSSQ) IC12.N5(VSS) IC12.P4(VSSQ) IC12.P6(VSSQ) R76.2
SYS_5V: C124.1(A) IC11.2(IN) IC11.3(IN)
VDD_3V3A: R75.1
VDD_3V3B: C125.2 C126.1 C127.1 C128.1 C129.1 IC12.C6(VCCQ) IC12.E6(VCC) IC12.F5(VCC) IC12.J10(VCC) IC12.K9(VCC) IC12.M4(VCCQ) IC12.N4(VCCQ) IC12.P3(VCCQ) IC12.P5(VCCQ) R77.2 R78.2 R79.2 R80.2 R81.2 R82.2 R83.2 R84.2 R85.2 R86.2 R87.2
eMMC_RSTn: IC12.K5(RST) R87.1 ; off-sheet eMMC_RSTn
MMC1_CLK: IC12.M6(CLK) R86.1 ; off-sheet MMC1_CLK
MMC1_CMD: IC12.M5(CMD) R85.1 ; off-sheet MMC1_CMD
MMC1_DAT0: IC12.A3(DAT0) R77.1 ; off-sheet MMC1_DAT0
MMC1_DAT1: IC12.A4(DAT1) R78.1 ; off-sheet MMC1_DAT1
MMC1_DAT2: IC12.A5(DAT2) R79.1 ; off-sheet MMC1_DAT2
MMC1_DAT3: IC12.B2(DAT3) R80.1 ; off-sheet MMC1_DAT3
MMC1_DAT4: IC12.B3(DAT4) R81.1 ; off-sheet MMC1_DAT4
MMC1_DAT5: IC12.B4(DAT5) R82.1 ; off-sheet MMC1_DAT5
MMC1_DAT6: IC12.B5(DAT6) R83.1 ; off-sheet MMC1_DAT6
MMC1_DAT7: IC12.B6(DAT7) R84.1 ; off-sheet MMC1_DAT7
USB0_DRVVBUS: IC11.4(~{EN}) R76.1
USB0_OCn: IC11.5(~{OC}) R75.2 ; off-sheet USB0_OCn
USB0_PWR: IC11.6(OUT) IC11.7(OUT) IC11.8(OUT)
NetC130_1: C130.1 IC12.C2(VCCI)

### Notes on the sheet
- Title
- Size:
- Date:
- A
- Number:
- Time:
- Revision:
- Sheet
- of
- File:

### Library data of the parts
C124 = CAP_POL_100uF: POL CAP 100uF SMD; Manufacturer: Panasonic; Dielectric Material: Aluminium; Ripple Current: 71mA; Tolerance: 20%; Voltage Rating: 6.3V; Life (Hours): 2000Hour; Leakage Current: 3uA; Lead Length: 2.6mm; Supplier 1: Digi-Key; Manufacturer Part Number: EEE-0JA101SP; Stock 1: 67789; Pricing 1: 1=0.35000, 10=0.24000, 100=0.14420, 500=0.10816 (USD); RoHS: Yes; Mount: Surface Mount,PCB; Case/Package: Radial; Number of Pins: 2; Contact Plating: Tin; Min Operating Temperature: -40°C; Max Operating Temperature: 85°C; Ripple Current (AC): 71mA; Packaging: Tape and Reel; Voltage Rating (DC): 6.3V; Package Quantity: 1; Termination: SMD/SMT; Voltage: 6.3V; Features: General Purpose; Diameter: 6.3mm; Length: 5.5mm; Height: 5.4mm; Height - Seated (Max): 0.213inch; Width: 6.6mm; Lead Pitch: 2.2mm; Radiation Hardening: No; REACH SVHC: No SVHC; Lead Free: Lead Free; ComponentLink1URL: https://datasheet.ciiva.com/11779/0900766b8078636e-11779744.pdf?src-supplier=RSComponents; ComponentLink1Description: https://datasheet.ciiva.com/11779/0900766b8078636e-11779744.pdf?src-supplier=RSComponents; ComponentLink2URL: https://datasheet.ciiva.com/14610/70255710-14610022.pdf?src-supplier=Allied+Electronics; ComponentLink2Description: https://datasheet.ciiva.com/14610/70255710-14610022.pdf?src-supplier=Allied+Electronics; ComponentLink3URL: https://datasheet.ciiva.com/30226/11aba0000ce2-30226184.pdf?src-supplier=Onlinecomponents.com; ComponentLink3Description: https://datasheet.ciiva.com/30226/11aba0000ce2-30226184.pdf?src-supplier=Onlinecomponents.com; ComponentLink4URL: https://datasheet.ciiva.com/16397/aba0000ce2-16397066.pdf?src-supplier=Future+Electronics; ComponentLink4Description: https://datasheet.ciiva.com/16397/aba0000ce2-16397066.pdf?src-supplier=Future+Electronics; ComponentLink5URL: https://datasheet.ciiva.com/46387/aba0000ce2-46387964.pdf?src-supplier=Element14; ComponentLink5Description: https://datasheet.ciiva.com/46387/aba0000ce2-46387964.pdf?src-supplier=Element14; ComponentLink6URL: https://datasheet.ciiva.com/14595/70255710-14595757.pdf?src-supplier=Allied+Electronics; ComponentLink6Description: https://datasheet.ciiva.com/14595/70255710-14595757.pdf?src-supplier=Allied+Electronics; ComponentLink7URL: https://datasheet.ciiva.com/2983/aba0000ce2-2983902.pdf?src-supplier=Avnet; ComponentLink7Description: https://datasheet.ciiva.com/2983/aba0000ce2-2983902.pdf?src-supplier=Avnet; ComponentLink8URL: https://datasheet.ciiva.com/43485/aba0000ce2-43485605.pdf?src-supplier=Farnell; ComponentLink8Description: https://datasheet.ciiva.com/43485/aba0000ce2-43485605.pdf?src-supplier=Farnell; ComponentLink9URL: https://datasheet.ciiva.com/24070/aba0000ce2-40801-24070230.pdf?src-supplier=Mouser; ComponentLink9Description: https://datasheet.ciiva.com/24070/aba0000ce2-40801-24070230.pdf?src-supplier=Mouser; ComponentLink10URL: https://datasheet.ciiva.com/46376/aba0000ce2-46376375.pdf?src-supplier=Element14; ComponentLink10Description: https://datasheet.ciiva.com/46376/aba0000ce2-46376375.pdf?src-supplier=Element14; ComponentLink11URL: https://datasheet.ciiva.com/6134/aba0000ce2-6134361.pdf?src-supplier=Farnell; ComponentLink11Description: https://datasheet.ciiva.com/6134/aba0000ce2-6134361.pdf?src-supplier=Farnell; ComponentLink12URL: https://datasheet.ciiva.com/16539/aba0000ce2-16539929.pdf?src-supplier=Avnet+Asia; ComponentLink12Description: https://datasheet.ciiva.com/16539/aba0000ce2-16539929.pdf?src-supplier=Avnet+Asia; ComponentLink13URL: https://datasheet.ciiva.com/15165/getdatasheetpartid-73778-15165850.pdf?src-supplier=Verical; ComponentLink13Description: https://datasheet.ciiva.com/15165/getdatasheetpartid-73778-15165850.pdf?src-supplier=Verical; ComponentLink14URL: https://datasheet.ciiva.com/17353/aba0000ce2-17353295.pdf?src-supplier=Avnet+Europe; ComponentLink14Description: https://datasheet.ciiva.com/17353/aba0000ce2-17353295.pdf?src-supplier=Avnet+Europe; Supplier Part Number 1: PCE3852CT-ND
C125 = CAP_10uF: MLCC 10uF 0805 SMD; Manufacturer: TDK; Tolerance: 10%; Dielectric Material: Ceramic; Voltage Rating: 10V; Dielectric: X6S; Supplier 1: Digi-Key; Supplier Part Number 1: 445-7613-1-ND; Manufacturer Part Number: C2012X6S1A106K085AC; RoHS: Yes; Stock 1: 46852; Pricing 1: 1=0.30000, 10=0.20500, 100=0.11610, 500=0.08198, 1000=0.07173 (USD); Packaging: Tape and Reel; Mount: Surface Mount; Case/Package: 0805; Weight: 0.000194oz; Case Code (Metric): 2012; Case Code (Imperial): 0805; Min Operating Temperature: -55°C; Max Operating Temperature: 105°C; Termination: SMD/SMT; Package Quantity: 4000; Voltage Rating (DC): 10V; Composition: Ceramic; Length: 2mm; Height: 1.25mm; Depth: 1.25mm; Width: 0.049inch; Thickness: 0.037inch; REACH SVHC: No SVHC; Lead Free: Lead Free; ComponentLink3URL: https://datasheet.ciiva.com/6290/tdkmlcccaprange-6290501.pdf?src-supplier=Digi-Key; ComponentLink3Description: Datasheet
C126-C129 = CAP_100nF: MLCC 100nF 0402 SMD; Manufacturer: KEMET; Tolerance: 10%; Voltage Rating (DC): 16V; Dielectric: X7R; Dissipation Factor: 3.5%; Supplier 1: Digi-Key; Manufacturer Part Number: C0402C104K4RACTU; Stock 1: 6512243; Pricing 1: 1=0.10000, 10=0.04200, 100=0.01860, 500=0.01328, 1000=0.01044, 2500=0.00949, 5000=0.00873 (USD); RoHS: Yes; Mount: Surface Mount; Case/Package: 0402; Case Code (Imperial): 0402; Case Code (Metric): 1005; Contact Plating: Tin,Matte; Min Operating Temperature: -55°C; Max Operating Temperature: 125°C; Packaging: Tape and Reel; Package Quantity: 10000; Voltage Rating: 16V; Termination: SMD/SMT; Length: 1mm; Height: 0.5mm; Width: 0.5mm; Depth: 0.5mm; Radiation Hardening: No; ComponentLink2URL: https://datasheet.ciiva.com/18192/getdatasheetpartid-385384-18192412.pdf?src-supplier=Verical; ComponentLink2Description: Datasheet; Supplier Part Number 1: 399-3521-1-ND
C130 = CAP_2.2uF: MLCC 2.2uF 0402 SMD; Manufacturer: TDK; Dielectric Material: Ceramic; Tolerance: 10%; Dielectric: X5R; Voltage Rating: 6.3V; Supplier 1: Digi-Key; Manufacturer Part Number: C1005X5R0J225K050BC; Stock 1: 256055; Pricing 1: 1=0.20000, 10=0.13800, 100=0.07010, 500=0.04794, 1000=0.04240, 2500=0.04056, 5000=0.03687 (USD); RoHS: Yes; Mount: Surface Mount; Case/Package: 0402; Number of Pins: 2; Weight: 2.3E-05oz; Case Code (Metric): 1005; Case Code (Imperial): 0402; Min Operating Temperature: -55°C; Max Operating Temperature: 85°C; Packaging: Tape and Reel; Voltage Rating (DC): 6.3V; Termination: SMD/SMT; Package Quantity: 1; Composition: Ceramic; Voltage: 6.3V; Length: 1mm; Height: 0.5mm; Width: 0.02inch; Depth: 0.5mm; Thickness: 0.022inch; Radiation Hardening: No; Lead Free: Lead Free; REACH SVHC: No SVHC; ComponentLink7Description: Datasheet; ComponentLink7URL: https://product.tdk.com/info/en/catalog/datasheets/mlcc_commercial_general_en.pdf?ref_disty=digikey
IC11 = TPS2061: IC 1.5A PWR DIST SWITCH 8-SOIC; Manufacturer: Texas Instruments; Manufacturer Part Number: TPS2051BDGNR; Number of Outputs: 1; Rds (On): 135 mOhm; Internal Switch(s): Yes; Current Limit: 1A; Voltage - Input: 2.7 V ~ 5.5 V; Supplier 1: Digi-Key; Supplier Part Number 1: 296-17313-6-ND; RoHS: RoHS Compliant; Category: Integrated Circuits (ICs); Stock 1: 7065; Pricing 1: 1=1.82, 10=1.642, 25=1.4708, 100=1.3224, 250=1.1742, 500=1.026, 1000=0.8493 (USD); Type: High Side Switch; Operating Temperature: -40°C ~ 85°C; Mounting Type: Surface Mount; Package / Case: 8-TSSOP, 8-MSOP (0.118", 3.00mm Width) Exposed Pad; Supplier Device Package: 8-MSOP-PowerPad; Packaging: Digi-Reel®; ComponentLink1URL: http://www.ti.com/lit/ds/symlink/tps2061.pdf; ComponentLink1Description: Datasheet
IC12 = IC_eMMC: Flash Card 4G-byte 3.3V MultiMedia Card 153-Pin WFBGA; Manufacturer: Micron Technology; Manufacturer Part Number: MTFC2GMVEA-0M WT; Lead Time: 2 weeks; Supplier 1: Arrow; Supplier Part Number 1: 53710993S251949N2406; RoHS: CHINA ROHS: Compliant / EU ROHS: Compliant; Stock 1: 1009; Pricing 1: 0=7.21 (USD); Package Quantity: 1; EU_ROHS_PROD_EXEMPTION_BY_SUPP: N/R; ComponentLink1URL: https://www.digikey.com/product-detail/en/kioxia-america-inc/THGBMNG5D1LBAIL/THGBMNG5D1LBAIL-ND/9841782; ComponentLink1Description: Digikey; Supplier 2: Mouser; Stock 2: 1469; Pricing 2: 1=5.85000, 10=5.34000, 25=5.24000, 50=5.20000, 100=4.67000, 250=4.65000, 500=4.36000, 1000=4.17000, 2500=3.91000 (USD); Supplier Part Number 2: 757-THGBMNG5D1LBAIL
R75-R87 = RES_10k: Resistor 10kOhm 0402 SMD; Manufacturer: Yageo; Temperature Coefficient: 100ppm/°C; Tolerance: 1%; Voltage Rating (DC): 50V; Power Rating: 62.5mW; Supplier 1: Digi-Key; Manufacturer Part Number: RC0402FR-0710KL; RoHS: Yes; Stock 1: 72891652; Pricing 1: 1=0.10000, 10=0.01500, 100=0.00600, 1000=0.00270, 2500=0.00235, 5000=0.00194 (USD); Composition: Thick Film; Height: 0.32mm; Number of Terminations: 2; Packaging: Tape and Reel; ComponentLink1URL: https://datasheet.ciiva.com/7660/38568-7660787.pdf?src-supplier=Element14; ComponentLink1Description: https://datasheet.ciiva.com/7660/38568-7660787.pdf?src-supplier=Element14; Case/Package: 0402; Number of Pins: 2; Case Code (Imperial): 0402; Case Code (Metric): 1005; Min Operating Temperature: -55°C; Max Operating Temperature: 155°C; Voltage Rating: 50V; Termination: SMD/SMT; Military Standard: Not; Working Voltage: 50V; Length: 1mm; Width: 0.5mm; Depth: 0.5mm; Lead Pitch: 0.2mm; REACH SVHC: No SVHC; Lead Free: Lead Free; ComponentLink2URL: https://datasheet.ciiva.com/7983/1018594-7983486.pdf?src-supplier=Element14; ComponentLink2Description: https://datasheet.ciiva.com/7983/1018594-7983486.pdf?src-supplier=Element14; ComponentLink3URL: https://datasheet.ciiva.com/7849/1784430-7849813.pdf?src-supplier=Element14; ComponentLink3Description: https://datasheet.ciiva.com/7849/1784430-7849813.pdf?src-supplier=Element14; ComponentLink4URL: https://datasheet.ciiva.com/7849/1686128-7849814.pdf?src-supplier=Element14; ComponentLink4Description: https://datasheet.ciiva.com/7849/1686128-7849814.pdf?src-supplier=Element14; ComponentLink5URL: https://datasheet.ciiva.com/7849/1784430-7849815.pdf?src-supplier=Element14; ComponentLink5Description: https://datasheet.ciiva.com/7849/1784430-7849815.pdf?src-supplier=Element14; ComponentLink6URL: https://datasheet.ciiva.com/22747/1018594-22747512.pdf?src-supplier=Element14; ComponentLink6Description: https://datasheet.ciiva.com/22747/1018594-22747512.pdf?src-supplier=Element14; ComponentLink7URL: https://datasheet.ciiva.com/12667/pyu-rc0402-51-rohs-l-6-r-12667067.pdf?src-supplier=Mouser; ComponentLink7Description: https://datasheet.ciiva.com/12667/pyu-rc0402-51-rohs-l-6-r-12667067.pdf?src-supplier=Mouser